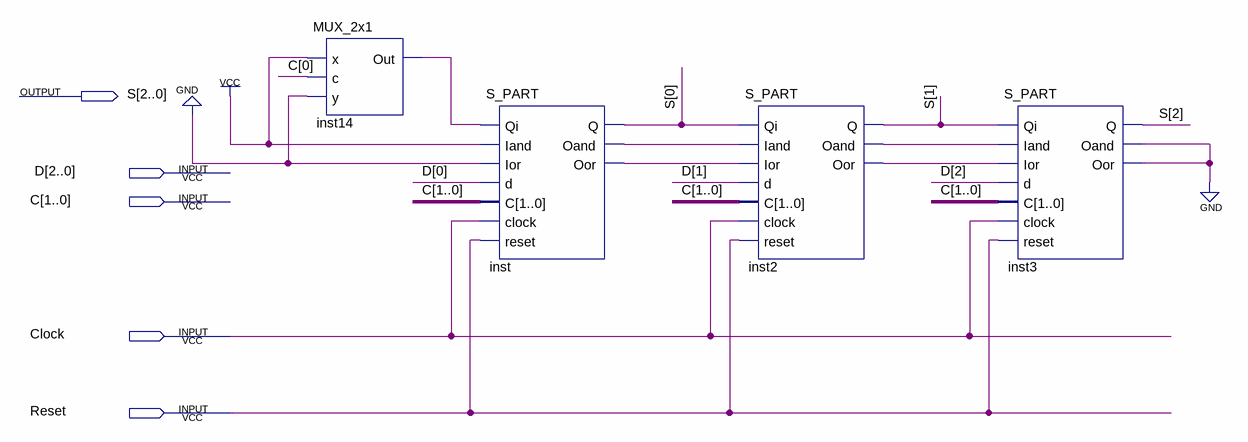
[diagram p0: schematic sheet]
// Quartus schematic S_COUNTER_3bits.bdf as structural Verilog: 4 symbols, 5 pins
module S_COUNTER_3bits (
  input  [2:0] D,
  input  [1:0] C,
  input  Clock,
  input  Reset,
  output [2:0] S
);

  wire inst2_oand, inst2_oor, inst3_oand, inst14_out, inst_oand, inst_oor;

  MUX_2x1 inst14 (.x(1'b1), .c(C[0]), .y(1'b0), .Out(inst14_out));
  S_PART inst (
    .Qi(inst14_out), .Iand(1'b1), .Ior(1'b0), .d(D[0]), .C(C), .clock(Clock), .reset(Reset), .Q(S[0]),
    .Oand(inst_oand), .Oor(inst_oor));
  S_PART inst2 (
    .Qi(S[0]), .Iand(inst_oand), .Ior(inst_oor), .d(D[1]), .C(C), .clock(Clock), .reset(Reset), .Q(S[1]),
    .Oand(inst2_oand), .Oor(inst2_oor));
  S_PART inst3 (
    .Qi(S[1]), .Iand(inst2_oand), .Ior(inst2_oor), .d(D[2]), .C(C), .clock(Clock), .reset(Reset), .Q(S[2]),
    .Oand(inst3_oand), .Oor(inst3_oand));
  // also tied to GND on the sheet: inst3_oand
endmodule
